# EAGLE design drunkGates (EAGLE 8.7.0)
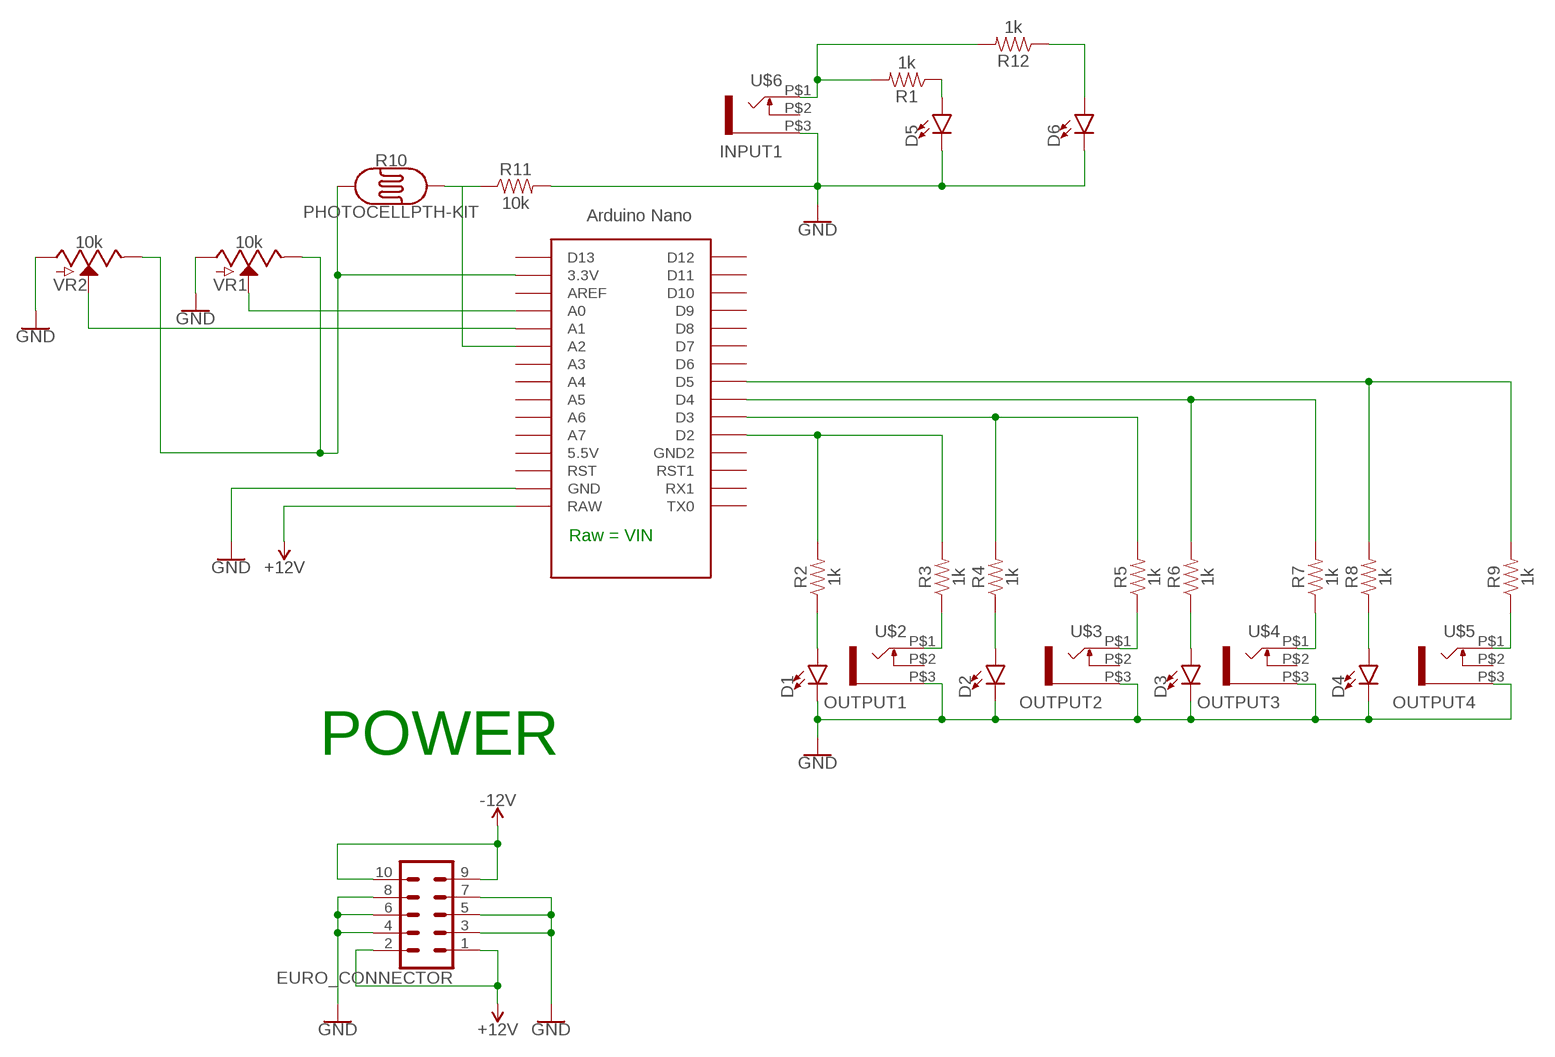
[diagram p0: schematic, sheet 1]

## Parts
D1  LED-3MM-NO_SILK  [LED_3MM-NS]
D2  LED-3MM-NO_SILK  [LED_3MM-NS]
D3  LED-3MM-NO_SILK  [LED_3MM-NS]
D4  LED-3MM-NO_SILK  [LED_3MM-NS]
D5  LED3MM  [LED_3MM]
D6  LED3MM  [LED_3MM]
EURO_CONNECTOR  CONN_05X2SHD  [2X5-SHROUDED]
R1  1k  1KOHM-HORIZ-1/4W-5%  [AXIAL-0.3]
R2  1k  1KOHM-HORIZ-1/4W-5%  [AXIAL-0.3]
R3  1k  1KOHM-HORIZ-1/4W-5%  [AXIAL-0.3]
R4  1k  1KOHM-HORIZ-1/4W-5%  [AXIAL-0.3]
R5  1k  1KOHM-HORIZ-1/4W-5%  [AXIAL-0.3]
R6  1k  1KOHM-HORIZ-1/4W-5%  [AXIAL-0.3]
R7  1k  1KOHM-HORIZ-1/4W-5%  [AXIAL-0.3]
R8  1k  1KOHM-HORIZ-1/4W-5%  [AXIAL-0.3]
R9  1k  1KOHM-HORIZ-1/4W-5%  [AXIAL-0.3]
R10  PHOTOCELLPTH-KIT  [PHOTOCELL-KIT]
R11  10k  1KOHM-HORIZ-1/4W-5%  [AXIAL-0.3]
R12  1k  1KOHM-HORIZ-1/4W-5%  [AXIAL-0.3]
U$1  NANO  [NANO]
U$2  OUTPUT1  WQP-PJ301M-12_JACK  [WQP-PJ301M-12_JACK]
U$3  OUTPUT2  WQP-PJ301M-12_JACK  [WQP-PJ301M-12_JACK]
U$4  OUTPUT3  WQP-PJ301M-12_JACK  [WQP-PJ301M-12_JACK]
U$5  OUTPUT4  WQP-PJ301M-12_JACK  [WQP-PJ301M-12_JACK]
U$6  INPUT1  WQP-PJ301M-12_JACK  [WQP-PJ301M-12_JACK]
VR1  10k  POTENTIOMETER-PTH-9MM-1/20W-20%  [POT-PTH-ALPS]
VR2  10k  POTENTIOMETER-PTH-9MM-1/20W-20%  [POT-PTH-ALPS]

## Nets
3.3V: R10.1 U$1.3.3V VR1.P$1(E) VR2.P$1(E)
+12V: EURO_CONNECTOR.1 EURO_CONNECTOR.2 U$1.RAW
-12V: EURO_CONNECTOR.9 EURO_CONNECTOR.10
GND: D1.K(C) D2.K(C) D3.K(C) D4.K(C) D5.K(C) D6.K(C) EURO_CONNECTOR.3 EURO_CONNECTOR.4 EURO_CONNECTOR.5 EURO_CONNECTOR.6 EURO_CONNECTOR.7 EURO_CONNECTOR.8 R11.P$2 U$1.GND U$2.P$3 U$3.P$3 U$4.P$3 U$5.P$3 U$6.P$3 VR1.P$3(A) VR2.P$3(A)
N$1: U$1.A0 VR1.P$2(S)
N$2: U$1.A1 VR2.P$2(S)
N$3: D6.A R12.P$1
N$4: D5.A R1.P$1
N$5: R5.P$1 U$3.P$1
N$6: R2.P$2 R3.P$2 U$1.D2
N$7: R4.P$2 R5.P$2 U$1.D3
N$8: R6.P$2 R7.P$2 U$1.D4
N$9: R8.P$2 R9.P$2 U$1.D5
N$10: D1.A R2.P$1
N$11: D2.A R4.P$1
N$12: D3.A R6.P$1
N$13: D4.A R8.P$1
N$14: R3.P$1 U$2.P$1
N$15: R7.P$1 U$4.P$1
N$16: R10.2 R11.P$1 U$1.A2
N$17: R9.P$1 U$5.P$1
N$18: R1.P$2 R12.P$2 U$6.P$1
Unconnected: U$1.5V(5.5V) U$1.A3 U$1.A4 U$1.A5 U$1.A6 U$1.A7 U$1.AREF U$1.D6 U$1.D7 U$1.D8 U$1.D9 U$1.D10 U$1.D11 U$1.D12 U$1.D13 U$1.GND1(GND2) U$1.ICSP1 U$1.ICSP2 U$1.ICSP3 U$1.ICSP4 U$1.ICSP5 U$1.ICSP6 U$1.RST U$1.RST1 U$1.RX1 U$1.TX0 U$2.P$2 U$3.P$2 U$4.P$2 U$5.P$2 U$6.P$2

## Notes on the sheet
- Raw = VIN
- POWER

## Library data of the parts
D1-D4 = SparkFun-LED:LED: LED (Generic) Standard schematic elements and footprints for 5mm, 3mm, 1206, and 0603 sized LEDs. Generic LEDs with no color specified.
D5 D6 = SparkFun-LED:LED: LED (Generic) Standard schematic elements and footprints for 5mm, 3mm, 1206, and 0603 sized LEDs. Generic LEDs with no color specified.; PROD_ID: DIO-08794
EURO_CONNECTOR = SparkFun-Connectors:CONN_05X2: Multi connection point. Often used as Generic Header-pin footprint for 0.1 inch spaced/style header connections For AVR SPI programming port, see special device with nice symbol: "AVR_SPI_PROG_5x2.dev" You can populate with any combo of single row headers, but if you'd like an exact match, check these: 2x5 AVR ICSP Male Header <https://www.sparkfun.com/products/778> (PRT-00778) 2x5 Pin Shrouded Header <https://www.sparkfun.com/products/8506> (PRT-08506) On any of the 0.1 inch spaced packages, you can populate with these: Break Away Headers - Straight <https://www.sparkfun.com/products/116> (PRT-00116) Break Away Male Headers - Right Angle <https://www.sparkfun.com/products/553> (PRT-00553) Female Headers <https://www.sparkfun.com/products/115> (PRT-00115) Break Away Headers - Machine Pin <https://www.sparkfun.com/products/117> (PRT-00117) Break Away Female Headers - Swiss Machine Pin <https://www.sparkfun.com/products/743> (PRT-00743) Special note: the shrouded connector mates well with our 5x2 ribbon cables: 2x5 Pin IDC Ribbon Cable <https://www.sparkfun.com/products/8535> (PRT-08535); PROD_ID: CONN-08671; SF_ID: PRT-08506
R1-R9 R12 = SparkFun-Resistors:1KOHM: 1kΩ resistor A resistor is a passive two-terminal electrical component that implements electrical resistance as a circuit element. Resistors act to reduce current flow, and, at the same time, act to lower voltage levels within circuits. - Wikipedia; PROD_ID: RES-08380
R10 = SparkFun-Sensors:PHOTOCELL: Photocell (Photodetector, Photo Resistor, CdS) This is a very small light sensor. A photocell changes (also called a photodetector, photo resistor, CdS or photoconductive cell) resistance depending on the amount of light it is exposed to. These little sensors make great ambient light triggers (when light in the room turns on, do something). Datasheet <http://cdn.sparkfun.com/datasheets/Sensors/LightImaging/SEN-09088.pdf> SparkFun Products Mini Photocell <https://www.sparkfun.com/products/9088> (SEN-09088); PROD_ID: COMP-09129; SF_ID: SEN-09088
R11 = SparkFun-Resistors:1KOHM: 1kΩ resistor A resistor is a passive two-terminal electrical component that implements electrical resistance as a circuit element. Resistors act to reduce current flow, and, at the same time, act to lower voltage levels within circuits. - Wikipedia; PROD_ID: RES-08380; VALUE: 1k
U$1 = Arduino-clone:NANO: Arduino Nano
U$2-U$6 = thonkiconn:WQP-PJ301M-12_JACK
VR1 VR2 = SparkFun-Resistors:POTENTIOMETER: Potentiometer (Pot) Three-terminal potentiometers, with an adjustable wiper and two adjustable resistors. A pot can be used to create a configurable voltage divider, or as a variable resistor. Variants ALPS_POT and ALPS_POT_KIT - PTH, breadboard compatible, 9mm square pots Rotary Potentiometer - Linear (10k ohm) <https://www.sparkfun.com/products/9288> (COM-09288) The KIT variant exposes copper on only one side of the PTH pad, so the part can only be assembled on one side of the PCB. Useful for beginner soldering kits.; PROD_ID: RES-09177; SF_SKU: COM-09288

## Board
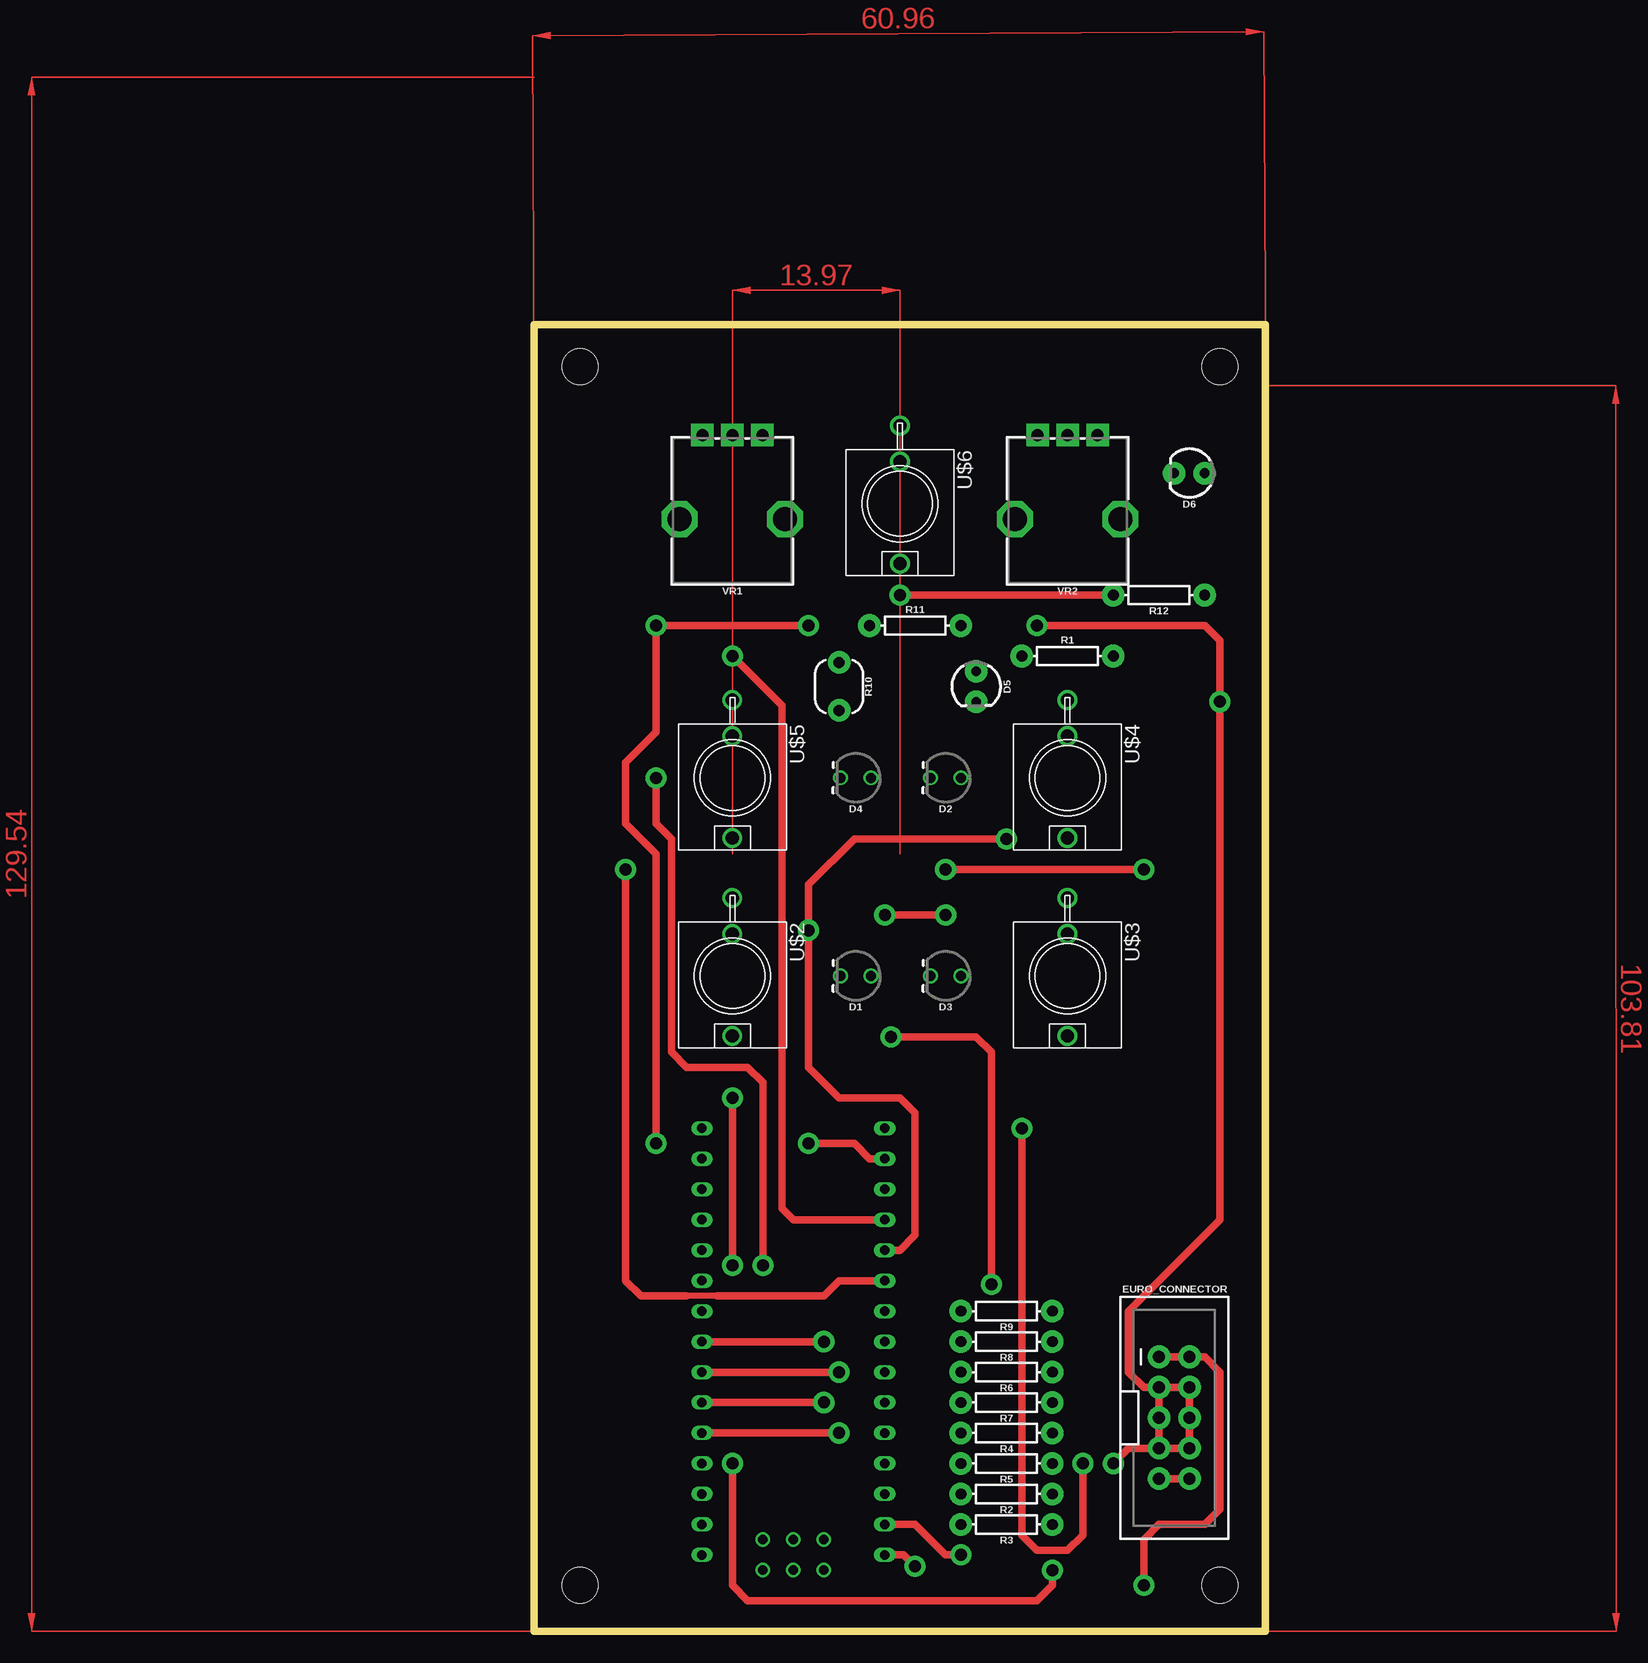
[diagram p1: board, top side]
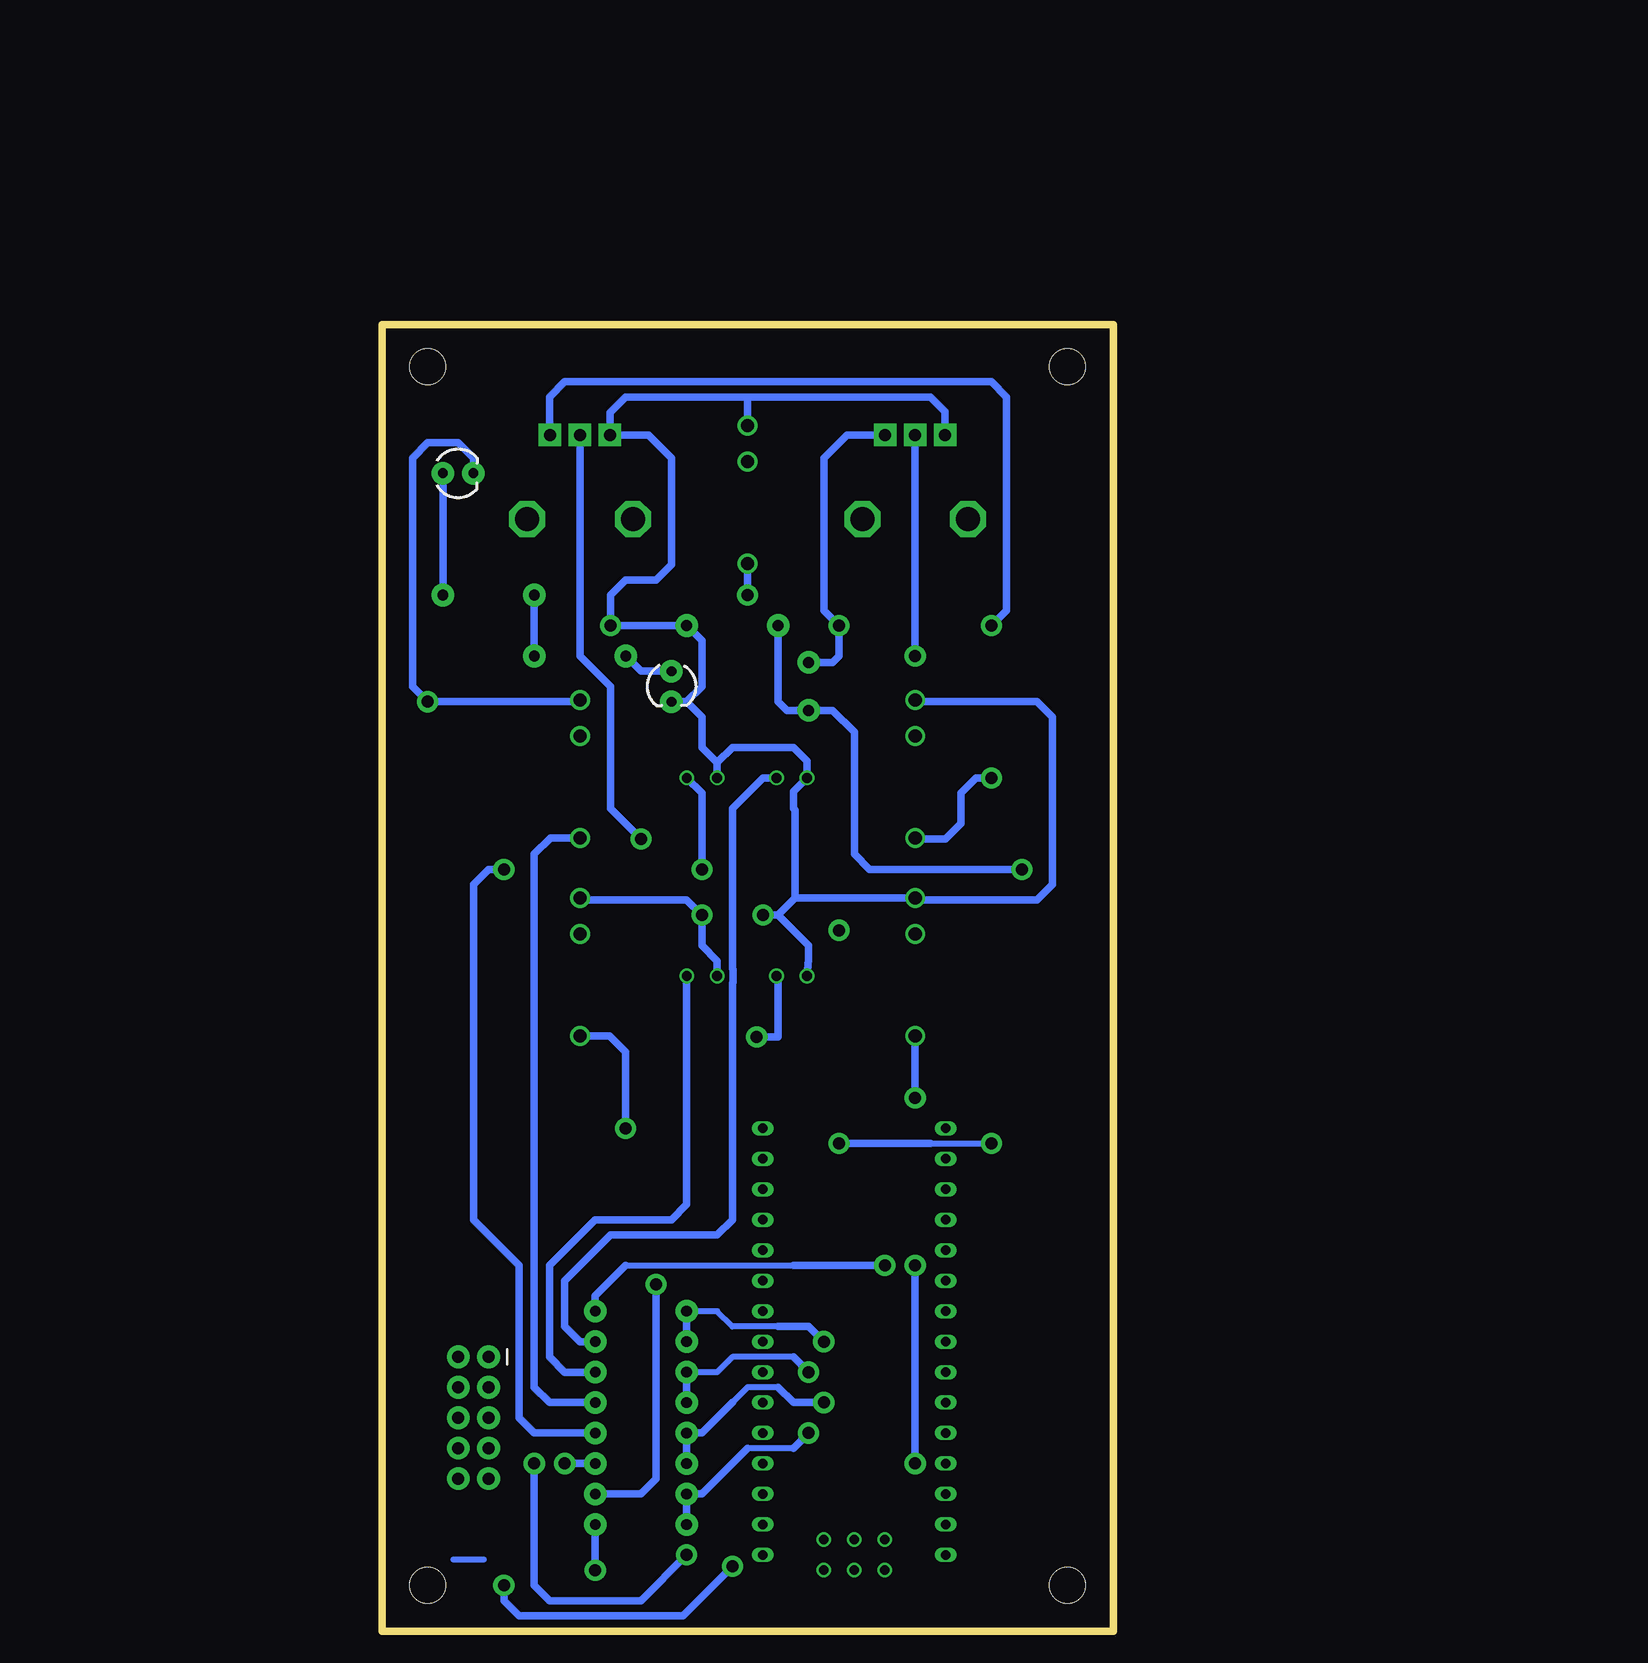
[diagram p2: board, bottom side, seen from below]

Size 60.94 x 108.89 mm. Coordinates in mm from the lower left corner, seen from the top.
Outline: 0,0 60.94,0 60.94,108.89 0,108.89 0,0
Copper layers (1*16): Top 0.035mm / dielectric 1.5mm / Bottom 0.035mm
Design rules "OthermillDRC_1_64_v2": minimum track width 16mil, minimum drill 31mil, track to track 0.39878125mm, track to pad 0.39878125mm, pad to pad 0.39878125mm, via to via 0.39878125mm, smd to smd 0mil, copper to edge 0mil, drill to drill 1mil, minimum pad ring 0mil, minimum via ring 15mil, stop-mask expansion 1mil, vias tented up to drill 30mil, thermal gap 10mil
Holes 3 mm at 57.15,105.41 3.81,105.41 3.81,3.81 57.15,3.81

### Footprints (pad centres in the part's own frame; a part is rotated, then mirrored left to right if it is on the bottom)
LED_3MM-NS = drill 0.813: A -1.27,0; K 1.27,0
LED_3MM = drill 0.813 pad 1.88: A -1.27,0; K 1.27,0
2X5-SHROUDED = drill 1.016 pad 1.88: 1 -1.27,5.08; 2 1.27,5.08; 3 -1.27,2.54; 4 1.27,2.54; 5 -1.27,0; 6 1.27,0; 7 -1.27,-2.54; 8 1.27,-2.54; 9 -1.27,-5.08; 10 1.27,-5.08
AXIAL-0.3 = drill 0.9 pad 1.88: P$1 -3.81,0; P$2 3.81,0
PHOTOCELL-KIT = drill 0.9 pad 1.88: 1 -2,0; 2 2,0
NANO = drill 0.8 long: 3.3V -10.16,24.13; 5V -10.16,-1.27; A0 -10.16,19.05; A1 -10.16,16.51; A2 -10.16,13.97; A3 -10.16,11.43; A4 -10.16,8.89; A5 -10.16,6.35; A6 -10.16,3.81; A7 -10.16,1.27; AREF -10.16,21.59; D2 5.08,1.27; D3 5.08,3.81; D4 5.08,6.35; D5 5.08,8.89; D6 5.08,11.43; D7 5.08,13.97; D8 5.08,16.51; D9 5.08,19.05; D10 5.08,21.59; D11 5.08,24.13; D12 5.08,26.67; D13 -10.16,26.67; GND -10.16,-6.35; GND1 5.08,-1.27; RAW -10.16,-8.89; RST -10.16,-3.81; RST1 5.08,-3.81; RX1 5.08,-6.35; TX0 5.08,-8.89 | drill 0.8: ICSP1 -5.08,-10.16; ICSP2 -5.08,-7.62; ICSP3 -2.54,-10.16; ICSP4 -2.54,-7.62; ICSP5 0,-10.16; ICSP6 0,-7.62
WQP-PJ301M-12_JACK = drill 1.1: P$1 0,5; P$2 0,-3.5; P$3 0,-6.5
POT-PTH-ALPS = drill 1 pad 1.88 square: P$1 7,-2.5; P$2 7,0; P$3 7,2.5 | drill 2 octagon: P$4 0,-4.4; P$5 0,4.4

### Placement (x,y rotation side)
D1  26.8,54.61 180 top
D2  34.29,71.12 180 top
D3  34.29,54.61 180 top
D4  26.8,71.12 180 top
D5  36.83,78.74 270 top
D6  54.61,96.52 180 top
EURO_CONNECTOR  53.34,17.78 0 top
R1  44.45,81.28 0 top
R2  39.37,11.43 180 top
R3  39.37,8.89 180 top
R4  39.37,16.51 180 top
R5  39.37,13.97 180 top
R6  39.37,21.59 180 top
R7  39.37,19.05 180 top
R8  39.37,24.13 180 top
R9  39.37,26.67 180 top
R10  25.4,78.74 270 top
R11  31.75,83.82 0 top
R12  52.07,86.36 180 top
U$1  19.05,15.24 0 bottom
U$2  16.51,54.61 180 top
U$3  44.45,54.61 180 top
U$4  44.45,71.12 180 top
U$5  16.51,71.12 180 top
U$6  30.48,93.98 180 top
VR1  16.51,92.71 90 top
VR2  44.45,92.71 90 top

### Tracks (layer width: path | path; a pad name or v marks a point on that pad's centre or on a via)
3.3V  (via drill 1)
  Top 0.61: v22.86,83.82 v10.16,83.82 10.16,74.93 7.62,72.39 7.62,67.31 10.16,64.77 v10.16,40.64 | v22.86,40.64 26.67,40.64 27.94,39.37 U$1.3.3V
  Bottom 0.508: 15.24,40.64 v10.16,40.64
  Bottom 0.61: VR1.P$1 22.21,99.71 24.13,97.79 24.13,85.09 v22.86,83.82 22.86,81.28 23.4,80.74 R10.1 | VR2.P$1 46.99,99.75 46.99,102.87 45.72,104.14 10.16,104.14 8.89,102.87 8.89,85.09 v10.16,83.82 | v22.86,40.64 15.24,40.64
+12V  (via drill 1)
  Top 0.61: EURO_CONNECTOR.1 EURO_CONNECTOR.2 55.88,22.86 57.15,21.59 57.15,10.16 55.88,8.89 52.07,8.89 50.8,7.62 v50.8,3.81 | v31.73,5.39 30.78,6.35 U$1.RAW
  Bottom 0.61: v50.8,3.81 50.8,2.54 49.53,1.27 35.86,1.27 v31.73,5.39
-12V
  Top 0.61: EURO_CONNECTOR.10 EURO_CONNECTOR.9
GND  (via drill 1)
  Top 0.61: EURO_CONNECTOR.3 EURO_CONNECTOR.4 EURO_CONNECTOR.6 EURO_CONNECTOR.8 EURO_CONNECTOR.7 | EURO_CONNECTOR.7 EURO_CONNECTOR.5 EURO_CONNECTOR.3 | v29.21,59.69 v34.29,59.69 | v48.26,13.97 49.53,15.24 EURO_CONNECTOR.7 | v35.56,6.35 34.29,6.35 31.75,8.89 U$1.GND | v41.91,83.82 55.88,83.82 57.15,82.55 v57.15,77.47 57.15,34.29 49.53,26.67 49.53,21.59 50.8,20.32 EURO_CONNECTOR.3
  Bottom 0.61: 29.21,59.56 v29.21,59.69 27.94,59.69 | D1.K 25.4,56.01 25.4,57.15 27.94,59.69 | VR1.P$3 14.01,101.64 15.24,102.87 30.48,102.87 | D3.K 33.02,55.88 34.29,57.15 v34.29,59.69 35.56,60.96 44.3,60.96 U$3.P$3 | 33.02,72.39 31.75,73.66 26.67,73.66 25.53,72.52 D4.K 26.67,69.98 26.67,68.58 26.52,68.43 26.52,61.11 | 33.02,72.39 D2.K | 33.02,72.39 34.29,73.66 34.29,76.2 35.56,77.47 | 26.52,61.11 U$2.P$3 16.36,60.96 6.35,60.96 5.08,62.23 5.08,76.2 6.35,77.47 16.36,77.47 U$5.P$3 | 26.52,61.11 27.94,59.69 | U$4.P$3 44.6,77.47 v57.15,77.47 58.42,78.74 58.42,97.79 57.15,99.06 54.61,99.06 53.34,97.79 D6.K | U$6.P$3 30.48,102.87 | 30.48,102.87 40.64,102.87 41.95,101.56 VR2.P$3 38.75,99.71 36.83,97.79 36.83,88.9 38.1,87.63 40.64,87.63 41.91,86.36 v41.91,83.82 R11.P$2 34.29,82.55 34.29,78.74 35.56,77.47 | v48.26,13.97 48.26,3.81 46.99,2.54 39.37,2.54 v35.56,6.35 | 35.56,77.47 D5.K
N$1  (via drill 1)
  Top 0.61: v16.51,81.28 20.63,77.16 20.63,35.24 21.59,34.29 U$1.A0
  Bottom 0.61: v16.51,81.28 VR1.P$2
N$2  (via drill 1)
  Top 0.61: v39.37,66.04 26.67,66.04 22.86,62.23 v22.86,58.42 22.86,46.99 25.4,44.45 30.48,44.45 31.75,43.18 31.75,33.02 30.48,31.75 U$1.A1
  Bottom 0.61: v39.37,66.04 41.91,68.58 41.91,78.74 44.45,81.28 VR2.P$2
N$3
  Bottom 0.61: R12.P$1 D6.A
N$4
  Bottom 0.61: R1.P$1 39.37,80.01 D5.A
N$5  (via drill 1)
  Top 0.61: v45.72,13.97 45.72,8 44.45,6.73 41.91,6.73 40.64,8 v40.64,41.91
  Bottom 0.61: R5.P$1 v45.72,13.97 | v40.64,41.91 40.64,48.26 41.99,49.61 U$3.P$1
N$6  (via drill 1)
  Top 0.61: U$1.D2 v25.4,16.51
  Bottom 0.508: 26.67,15.24 30.48,15.24
  Bottom 0.61: R3.P$2 R2.P$2 34.29,11.43 30.48,15.24 | v25.4,16.51 26.67,15.24
N$7  (via drill 1)
  Top 0.61: U$1.D3 v24.13,19.05
  Bottom 0.508: 27.94,20.32 30.48,20.32 31.75,19.05
  Bottom 0.61: R5.P$2 R4.P$2 34.29,16.51 31.75,19.05 | v24.13,19.05 26.67,19.05 27.94,20.32
N$8  (via drill 1)
  Top 0.61: U$1.D4 v25.4,21.59
  Bottom 0.508: 26.67,22.86 31.75,22.86 33.02,21.59 R6.P$2
  Bottom 0.61: R7.P$2 R6.P$2 | v25.4,21.59 26.67,22.86
N$9  (via drill 1)
  Top 0.61: U$1.D5 v24.13,24.13
  Bottom 0.508: 27.94,25.4 31.75,25.4 33.02,26.67 R9.P$2
  Bottom 0.61: R8.P$2 R9.P$2 | v24.13,24.13 25.4,25.4 27.94,25.4
N$10  (via drill 1)
  Top 0.61: v29.72,49.53 36.83,49.53 38.1,48.26 v38.1,28.89
  Bottom 0.61: v29.72,49.53 27.94,49.53 27.94,54.61 D1.A | R2.P$1 39.37,11.43 38.1,12.7 v38.1,28.89
N$11  (via drill 1)
  Top 0.61: v50.8,63.5 v34.29,63.5
  Bottom 0.61: R4.P$1 48.26,16.51 49.53,17.78 49.53,30.48 53.34,34.29 53.34,62.23 52.07,63.5 v50.8,63.5 | D2.A 34.29,69.85 v34.29,63.5
N$12
  Bottom 0.61: D3.A 35.56,35.56 36.83,34.29 43.18,34.29 46.99,30.48 46.99,22.86 45.72,21.59 R6.P$1
N$13
  Bottom 0.61: D4.A 29.21,71.12 31.75,68.58 31.75,55.2 31.71,55.15 31.71,54.07 31.75,54.02 31.75,34.29 33.02,33.02 41.91,33.02 45.72,29.21 45.72,25.4 44.45,24.13 R8.P$1
N$14  (via drill 1)
  Top 0.61: v16.51,44.45 v16.51,30.48 | v43.18,5.08 43.18,3.81 41.91,2.54 17.78,2.54 16.51,3.81 v16.51,13.97
  Bottom 0.61: U$2.P$1 v16.51,44.45 | v16.51,30.48 v16.51,13.97 | v43.18,5.08 R3.P$1
N$15
  Bottom 0.61: R7.P$1 46.99,19.05 48.26,20.32 48.26,64.77 46.91,66.12 U$4.P$1
N$16  (via drill 1 pad 1)
  Top 0.508: 15.24,27.94 12.7,27.94
  Top 0.61: U$1.A2 25.4,29.21 24.13,27.94 15.24,27.94 | v7.62,63.5 7.62,29.21 8.89,27.94 12.7,27.94
  Bottom 0.61: v7.62,63.5 20.32,63.5 21.59,64.77 21.59,74.93 23.4,76.74 R10.2 27.21,76.74 27.94,77.47 R11.P$1
N$17  (via drill 1)
  Top 0.61: v19.05,30.48 19.05,45.72 17.78,46.99 12.7,46.99 11.43,48.26 11.43,66.04 10.16,67.31 v10.16,71.12
  Bottom 0.508: 40.64,30.48 26.67,30.48
  Bottom 0.61: R9.P$1 43.18,27.94 40.64,30.48 | 26.67,30.48 v19.05,30.48 | v10.16,71.12 11.43,71.12 12.7,69.85 12.7,67.31 13.97,66.04 16.43,66.04 U$5.P$1
N$18  (via drill 1 pad 1)
  Top 0.61: R12.P$2 v30.48,86.36
  Bottom 0.61: v30.48,86.36 U$6.P$1 | R1.P$2 R12.P$2
N$19
  Bottom 0.508: 54.99,5.97 52.45,5.97
(copper drawn outside any net)
  shapes: Top area x4